# EAGLE schematic aw_201_clock (EAGLE 6.4)
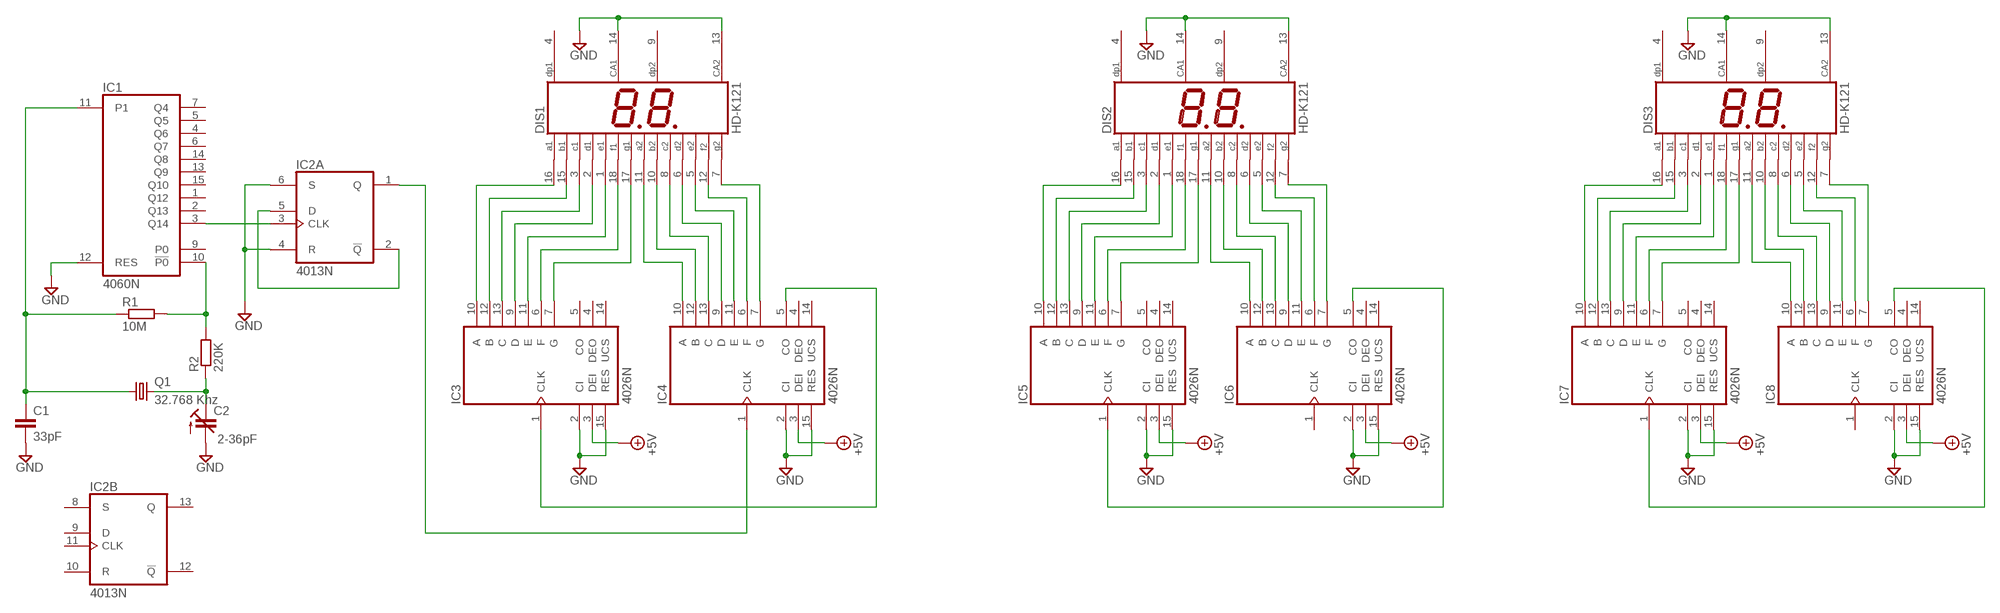
[diagram p0: schematic, sheet 1]

## Parts
C1  33pF  C-EU050-024X044  [C050-024X044]
C2  2-36pF  C-TRIMM3050.504  [CTRIM3050.504]
DIS1  HD-K121  [HDSP-R]
DIS2  HD-K121  [HDSP-R]
DIS3  HD-K121  [HDSP-R]
IC1  4060N  [DIL16]
IC2  4013N  [DIL14]
IC3  4026N  [DIL16]
IC4  4026N  [DIL16]
IC5  4026N  [DIL16]
IC6  4026N  [DIL16]
IC7  4026N  [DIL16]
IC8  4026N  [DIL16]
Q1  32.768 Khz  CRYSTALTC26V  [TC26V]
R1  10M  R-EU_0207/10  [0207/10]
R2  220K  R-EU_0207/10  [0207/10]

## Nets
+5V: IC3.3(DEI) IC4.3(DEI) IC5.3(DEI) IC6.3(DEI) IC7.3(DEI) IC8.3(DEI)
GND: C1.2 C2.2(A) DIS1.13(CA2) DIS1.14(CA1) DIS2.13(CA2) DIS2.14(CA1) DIS3.13(CA2) DIS3.14(CA1) IC1.12(RES) IC2.4(A:R) IC2.6(A:S) IC3.2(CI) IC3.15(RES) IC4.2(CI) IC4.15(RES) IC5.2(CI) IC5.15(RES) IC6.2(CI) IC6.15(RES) IC7.2(CI) IC7.15(RES) IC8.2(CI) IC8.15(RES)
N$1: C1.1 IC1.11(P1) Q1.1 R1.1
N$2: IC1.10(!P0) R1.2 R2.2
N$3: C2.1(E) Q1.2 R2.1
N$4: IC2.2(A:!Q) IC2.5(A:D)
N$5: IC1.3(Q14) IC2.3(A:CLK)
N$6: DIS1.11(A2) IC4.10(A)
N$7: DIS1.10(B2) IC4.12(B)
N$8: DIS1.8(C2) IC4.13(C)
N$9: DIS1.6(D2) IC4.9(D)
N$10: DIS1.5(E2) IC4.11(E)
N$11: DIS1.12(F2) IC4.6(F)
N$12: DIS1.7(G2) IC4.7(G)
N$13: DIS1.17(G1) IC3.7(G)
N$14: DIS1.18(F1) IC3.6(F)
N$15: DIS1.1(E1) IC3.11(E)
N$16: DIS1.2(D1) IC3.9(D)
N$17: DIS1.3(C1) IC3.13(C)
N$18: DIS1.15(B1) IC3.12(B)
N$19: DIS1.16(A1) IC3.10(A)
N$20: IC3.1(CLK) IC4.5(CO)
N$21: DIS2.10(B2) IC6.12(B)
N$22: DIS2.8(C2) IC6.13(C)
N$23: DIS2.6(D2) IC6.9(D)
N$24: DIS2.5(E2) IC6.11(E)
N$25: DIS2.12(F2) IC6.6(F)
N$26: DIS2.7(G2) IC6.7(G)
N$27: DIS2.11(A2) IC6.10(A)
N$28: DIS2.17(G1) IC5.7(G)
N$29: DIS2.18(F1) IC5.6(F)
N$30: DIS2.1(E1) IC5.11(E)
N$31: DIS2.2(D1) IC5.9(D)
N$32: DIS2.3(C1) IC5.13(C)
N$33: DIS2.15(B1) IC5.12(B)
N$34: DIS2.16(A1) IC5.10(A)
N$35: IC5.1(CLK) IC6.5(CO)
N$36: DIS3.10(B2) IC8.12(B)
N$37: DIS3.8(C2) IC8.13(C)
N$38: DIS3.6(D2) IC8.9(D)
N$39: DIS3.5(E2) IC8.11(E)
N$40: DIS3.12(F2) IC8.6(F)
N$41: DIS3.7(G2) IC8.7(G)
N$42: DIS3.11(A2) IC8.10(A)
N$43: DIS3.17(G1) IC7.7(G)
N$44: DIS3.18(F1) IC7.6(F)
N$45: DIS3.1(E1) IC7.11(E)
N$46: DIS3.2(D1) IC7.9(D)
N$47: DIS3.3(C1) IC7.13(C)
N$48: DIS3.15(B1) IC7.12(B)
N$49: DIS3.16(A1) IC7.10(A)
N$50: IC7.1(CLK) IC8.5(CO)
N$51: IC2.1(A:Q) IC4.1(CLK)
Unconnected: DIS1.4(DP1) DIS1.9(DP2) DIS2.4(DP1) DIS2.9(DP2) DIS3.4(DP1) DIS3.9(DP2) IC1.1(Q12) IC1.2(Q13) IC1.4(Q6) IC1.5(Q5) IC1.6(Q7) IC1.7(Q4) IC1.9(P0) IC1.13(Q9) IC1.14(Q8) IC1.15(Q10) IC2.8(B:S) IC2.9(B:D) IC2.10(B:R) IC2.11(B:CLK) IC2.12(B:!Q) IC2.13(B:Q) IC3.4(DEO) IC3.5(CO) IC3.14(UCS) IC4.4(DEO) IC4.14(UCS) IC5.4(DEO) IC5.5(CO) IC5.14(UCS) IC6.1(CLK) IC6.4(DEO) IC6.14(UCS) IC7.4(DEO) IC7.5(CO) IC7.14(UCS) IC8.1(CLK) IC8.4(DEO) IC8.14(UCS)

## Power pins joined to a net without a drawn wire
VDD: IC1.16(VDD) IC2.14(P:VDD) IC3.16(VDD) IC4.16(VDD) IC5.16(VDD) IC6.16(VDD) IC7.16(VDD) IC8.16(VDD)
VSS: IC1.8(VSS) IC2.7(P:VSS) IC3.8(VSS) IC4.8(VSS) IC5.8(VSS) IC6.8(VSS) IC7.8(VSS) IC8.8(VSS)

## Library data of the parts
C1 = rcl:C-EU: CAPACITOR, European symbol
C2 = rcl:C-TRIMM: Trimm capacitor
DIS1-DIS3 = display-hp:HD-K121: LED DISPLAY 2 x 1 character 7 segment, decimal points right; OC_FARNELL: unknown; OC_NEWARK: unknown
IC1 = 40xx:4060: 14-stage binary/ripple COUNTER
IC2 = 40xx:4013: Dual D FLIP FLOP, set/reset
IC3-IC8 = 40xx:4026: Decade COUNTER/DIVIDER, 7-seg. outputs
Q1 = crystal:CRYSTAL: CRYSTAL; OC_FARNELL: unknown; OC_NEWARK: unknown
R1 R2 = resistor:R-EU_: RESISTOR, European symbol